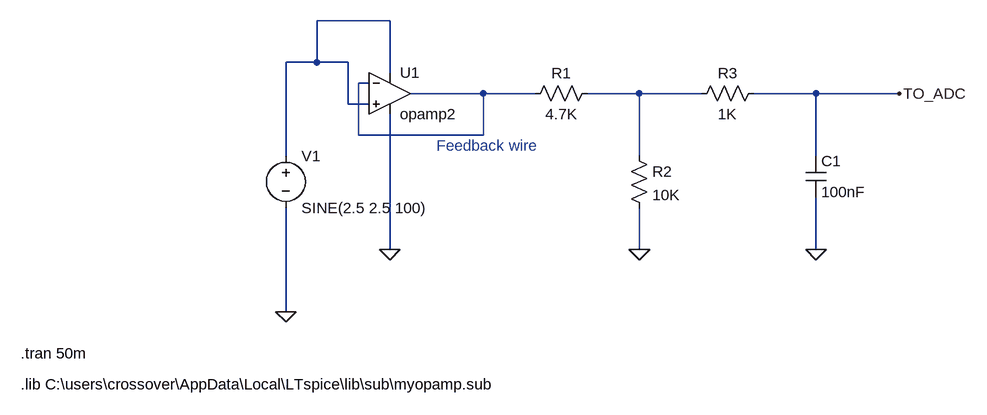
[diagram p0: schematic Signal Conditioning Simulation.asc]
Signal Conditioning Simulation.asc, the LTspice schematic file:
Version 4.1
SHEET 1 1160 680
WIRE 144 -96 32 -96
WIRE 32 -32 32 -96
WIRE 32 -32 -16 -32
WIRE 80 -32 32 -32
WIRE 144 -16 144 -96
WIRE 112 0 96 0
WIRE 288 16 176 16
WIRE 368 16 288 16
WIRE 528 16 448 16
WIRE 624 16 528 16
WIRE 800 16 704 16
WIRE 928 16 800 16
WIRE 80 32 80 -32
WIRE 112 32 80 32
WIRE 96 80 96 0
WIRE 288 80 288 16
WIRE 288 80 96 80
WIRE -16 112 -16 -32
WIRE 528 112 528 16
WIRE 800 112 800 16
WIRE 144 256 144 48
WIRE 528 256 528 192
WIRE 800 256 800 176
WIRE -16 352 -16 192
FLAG -16 352 0
FLAG 144 256 0
FLAG 528 256 0
FLAG 800 256 0
FLAG 928 16 TO_ADC
SYMBOL voltage -16 96 R0
WINDOW 123 0 0 Left 0
WINDOW 39 0 0 Left 0
SYMATTR InstName V1
SYMATTR Value SINE(2.5 2.5 100)
SYMBOL OpAmps\\opamp2 144 -48 R0
SYMATTR InstName U1
SYMBOL res 464 0 R90
WINDOW 0 0 56 VBottom 2
WINDOW 3 32 56 VTop 2
SYMATTR InstName R1
SYMATTR Value 4.7K
SYMBOL res 512 96 R0
SYMATTR InstName R2
SYMATTR Value 10K
SYMBOL res 720 0 R90
WINDOW 0 0 56 VBottom 2
WINDOW 3 32 56 VTop 2
SYMATTR InstName R3
SYMATTR Value 1K
SYMBOL cap 784 112 R0
SYMATTR InstName C1
SYMATTR Value 100nF
TEXT 216 96 Left 2 ;Feedback wire
TEXT -424 416 Left 2 !.tran 50m
TEXT -424 464 Left 2 !.lib C:\\users\\crossover\\AppData\\Local\\LTspice\\lib\\sub\\myopamp.sub

The netlist it stands for:
* Signal Conditioning Simulation.asc
V1 N001 0 SINE(2.5 2.5 100)
X§U1 N001 N002 N001 0 N002 opamp2  ; pins In+ In- V+ V- OUT
R1 N003 N002 4.7K
R2 N003 0 10K
R3 TO_ADC N003 1K
C1 TO_ADC 0 100nF
* Feedback wire
.tran 50m
.lib C:\users\crossover\AppData\Local\LTspice\lib\sub\myopamp.sub
.backanno
.end